# Altium schematic sheet Arduino_schematics.SchDoc: Data Logger - Arduino
size A3; DocumentNumber: DL-MB-2; SheetNumber: 2; SheetTotal: 11
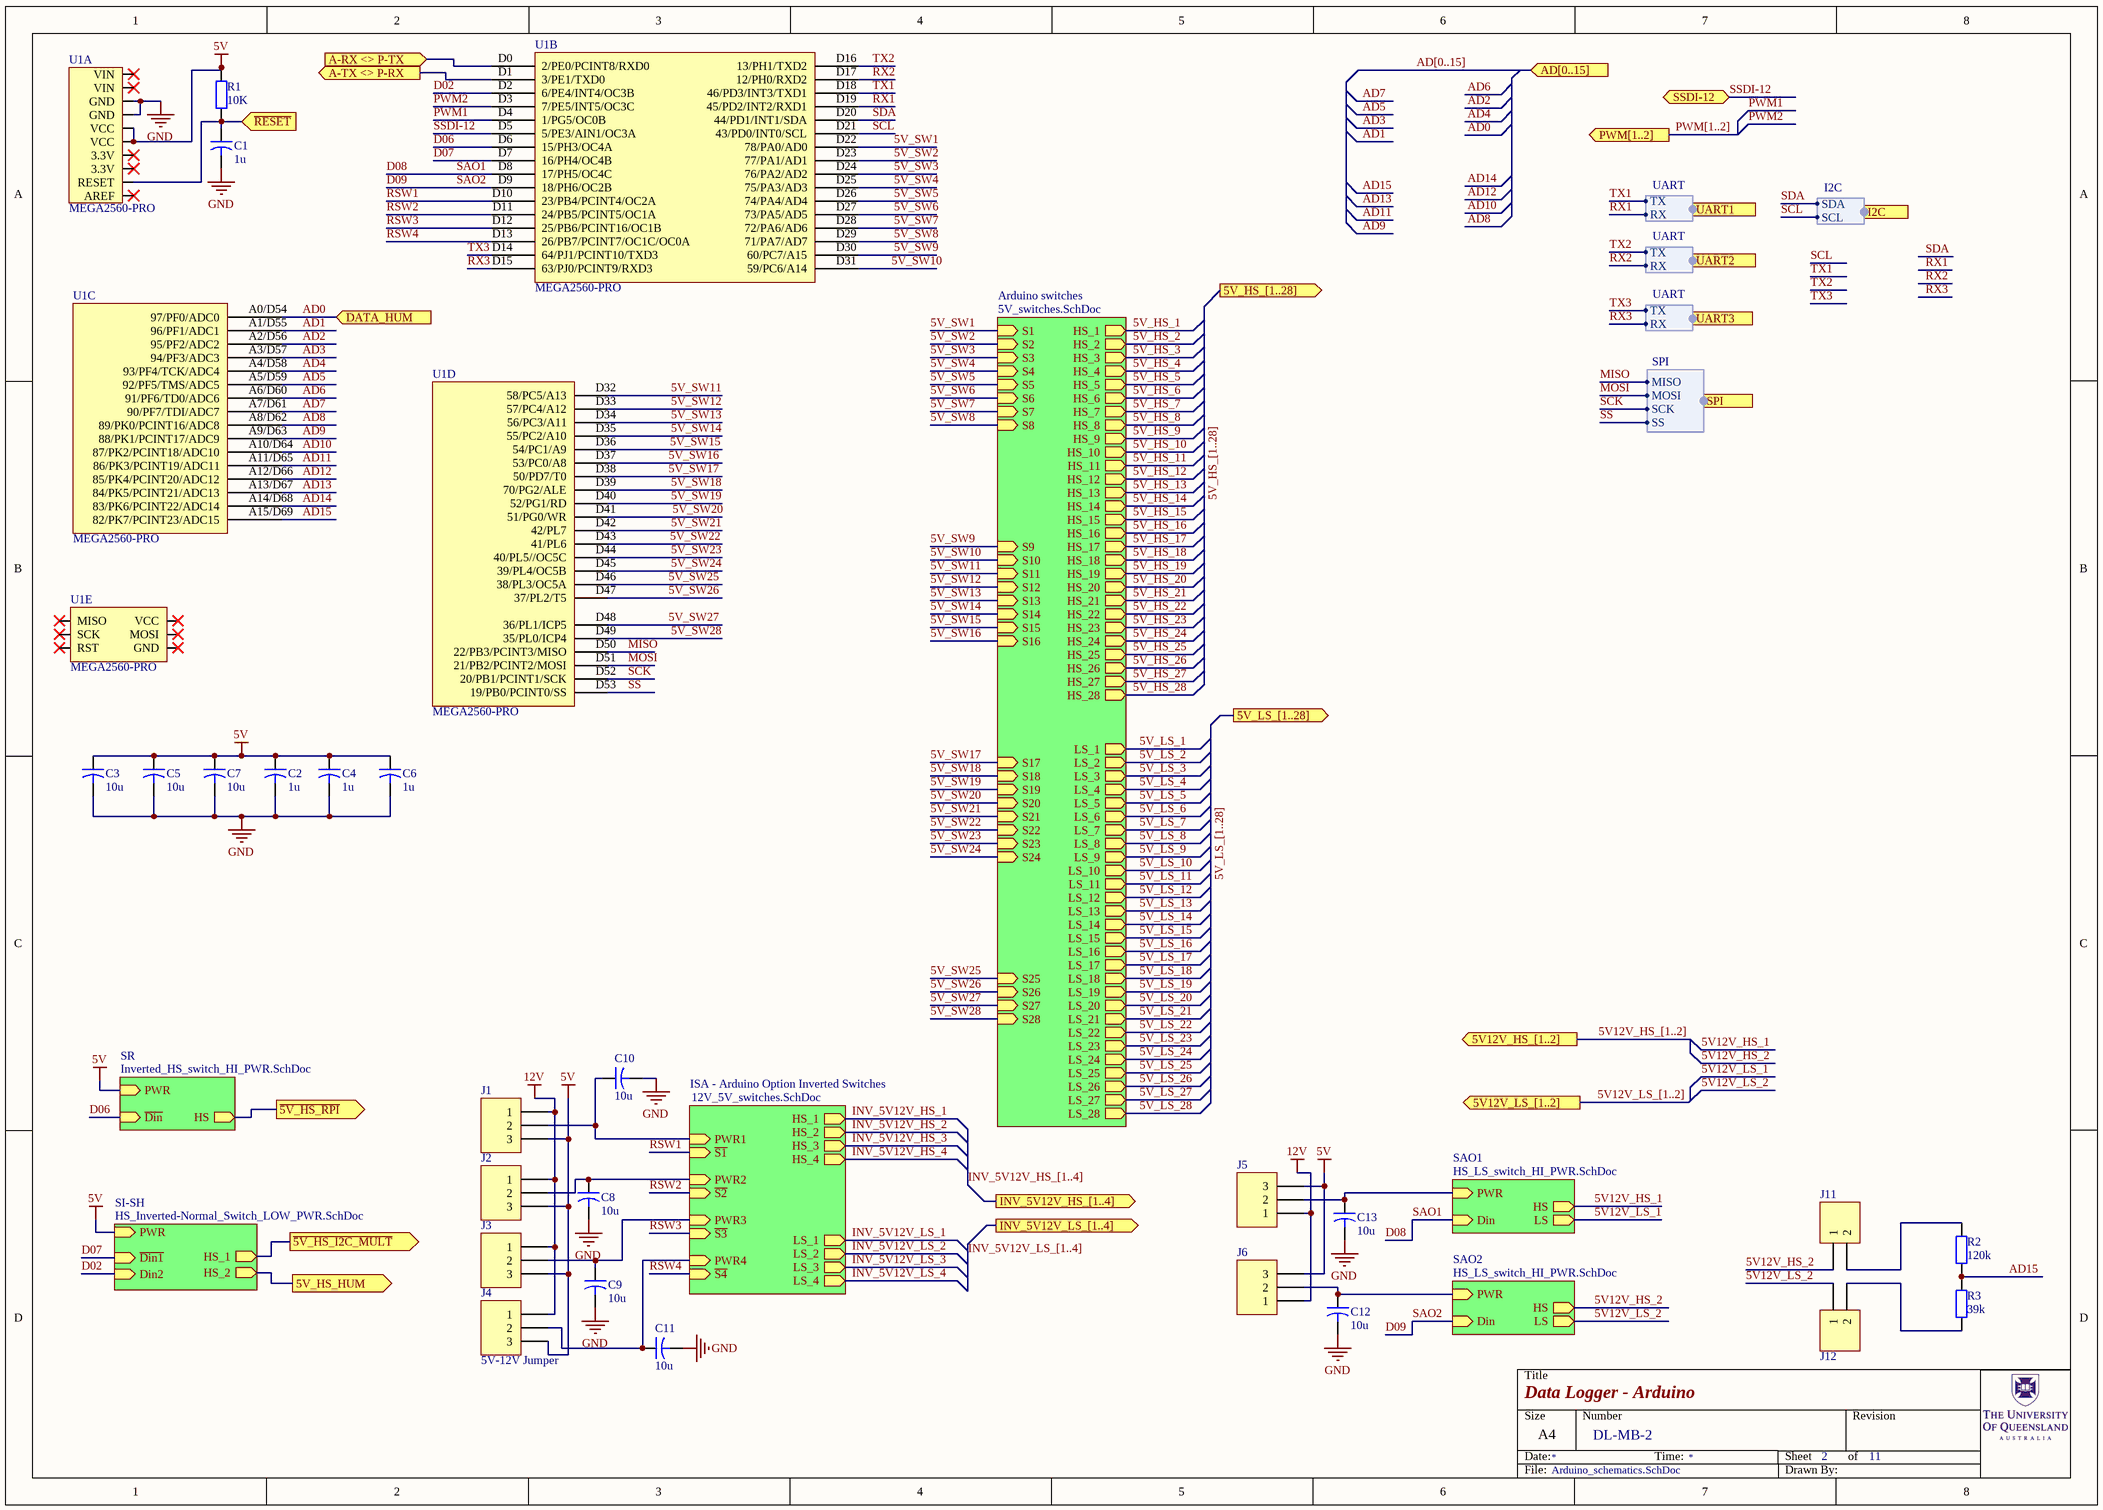
[diagram p0: Arduino_schematics.SchDoc]

## Parts
C1  1u  [CAPR5-4X5]
C2  1u  [CAPR5-4X5]
C3  10u  [CAPAE9083X80M]
C4  1u  [CAPR5-4X5]
C5  10u  [CAPAE9083X80M]
C6  1u  [CAPR5-4X5]
C7  10u  [CAPAE9083X80M]
C8  10u  [CAPAE9083X80M]
C9  10u  [CAPAE9083X80M]
C10  10u  [CAPAE9083X80M]
C11  10u  [CAPAE9083X80M]
C12  10u  [CAPAE9083X80M]
C13  10u  [CAPAE9083X80M]
J1  5V-12V Jumper  [HDR1X3]  (value not drawn)
J2  5V-12V Jumper  [HDR1X3]  (value not drawn)
J3  5V-12V Jumper  [HDR1X3]  (value not drawn)
J4  5V-12V Jumper  [HDR1X3]
J5  Header 3  [HDR1X3]  (value not drawn)
J6  Header 3  [HDR1X3]  (value not drawn)
J11  Header 2  [HDR1X2]  (value not drawn)
J12  Header 2  [HDR1X2]  (value not drawn)
R1  10K  [RES-1206_M]
R2  120k  [RES-1206_M]
R3  39k  [RES-1206_M]
U1  MEGA2560-PRO  [MEGA2560PRO-EMBED-IO]  (parts A,B,C,D,E of 5)

## Sub-sheets
Arduino switches = 5V_switches.SchDoc: S1 (in), S2 (in), S3 (in), S4 (in), S5 (in), S6 (in), S7 (in), S8 (in), S9 (in), S10 (in), S11 (in), S12 (in), S13 (in), S14 (in), S15 (in), S16 (in), S17 (in), S18 (in), S19 (in), S20 (in), S21 (in), S22 (in), S23 (in), S24 (in), S25 (in), S26 (in), S27 (in), HS_1 (out), HS_2 (out), HS_3 (out), HS_4 (out), HS_5 (out), HS_6 (out), HS_7 (out), HS_8 (out), HS_9 (out), HS_10 (out), HS_11 (out), HS_12 (out), HS_13 (out), HS_14 (out), HS_15 (out), HS_16 (out), HS_17 (out), HS_18 (out), HS_19 (out), HS_20 (out), HS_21 (out), HS_22 (out), HS_23 (out), HS_24 (out), HS_25 (out), HS_26 (out), HS_27 (out), S28 (in), HS_28 (out), LS_1 (out), LS_2 (out), LS_3 (out), LS_4 (out), LS_5 (out), LS_6 (out), LS_7 (out), LS_8 (out), LS_9 (out), LS_10 (out), LS_11 (out), LS_12 (out), LS_13 (out), LS_14 (out), LS_15 (out), LS_16 (out), LS_17 (out), LS_18 (out), LS_19 (out), LS_20 (out), LS_21 (out), LS_22 (out), LS_23 (out), LS_24 (out), LS_25 (out), LS_26 (out), LS_27 (out), LS_28 (out)
ISA - Arduino Option Inverted Switches = 12V_5V_switches.SchDoc: ~{S1} (in), ~{S2} (in), ~{S3} (in), ~{S4} (in), HS_1 (out), HS_2 (out), HS_3 (out), HS_4 (out), LS_1 (out), LS_2 (out), LS_3 (out), LS_4 (out), PWR1 (in), PWR2 (in), PWR3 (in), PWR4 (in)
SAO1 = HS_LS_switch_HI_PWR.SchDoc: Din (in), HS (out), LS (out), PWR (in)
SAO2 = HS_LS_switch_HI_PWR.SchDoc: Din (in), HS (out), LS (out), PWR (in)
SI-SH = HS_Inverted-Normal_Switch_LOW_PWR.SchDoc: ~{Din1} (in), HS_1 (out), PWR (in), Din2 (in), HS_2 (out)
SR = Inverted_HS_switch_HI_PWR.SchDoc: ~{Din} (in), HS (out), PWR (in)

## Ports
5V12V_HS_[1..2] (out), 5V12V_LS_[1..2] (out), 5V_HS_[1..28] (out), 5V_HS_HUM (out), 5V_LS_[1..28] (out), A-RX <> P-TX (in), A-TX <> P-RX (out), AD[0..15] (in), DATA_HUM (in), I2C (harness I2C), INV_5V12V_HS_[1..4] (out), INV_5V12V_LS_[1..4] (out), PWM[1..2] (out), SPI (harness SPI), SSDI-12 (bidir), UART1 (harness UART), UART2 (harness UART), UART3 (harness UART), ~{5V_HS_I2C_MULT} (out), ~{5V_HS_RPI} (out), ~{RESET} (in)

## Harnesses
SPI: MISO, MOSI, SCK, SS
UART: TX, RX
I2C: SDA, SCL

## Nets
5V: C2.1 C3.1 C4.1 C5.1 C6.1 C7.1 J1.3 J2.3 J3.3 J4.3 J5.3 J6.3 R1.2 U1.VCC@1(VCC) U1.VCC@2(VCC) ; sheet SI-SH/PWR, sheet SR/PWR
12V: J1.1 J2.1 J3.1 J4.1 J5.1 J6.1
GND: C1.2 C2.2 C3.2 C4.2 C5.2 C6.2 C7.2 C8.2 C9.2 C10.2 C11.2 C12.2 C13.2 U1.GND@1(GND) U1.GND@2(GND)
~{5V_HS_I2C_MULT}: port ~{5V_HS_I2C_MULT}, sheet SI-SH/HS_1
~{5V_HS_RPI}: port ~{5V_HS_RPI}, sheet SR/HS
5V12V_HS_1: sheet SAO1/HS
5V12V_HS_2: J11.1 ; sheet SAO2/HS
5V12V_LS_1: sheet SAO1/LS
5V12V_LS_2: J12.1 ; sheet SAO2/LS
5V_HS_1: sheet Arduino switches/HS_1
5V_HS_2: sheet Arduino switches/HS_2
5V_HS_3: sheet Arduino switches/HS_3
5V_HS_4: sheet Arduino switches/HS_4
5V_HS_5: sheet Arduino switches/HS_5
5V_HS_6: sheet Arduino switches/HS_6
5V_HS_7: sheet Arduino switches/HS_7
5V_HS_8: sheet Arduino switches/HS_8
5V_HS_9: sheet Arduino switches/HS_9
5V_HS_10: sheet Arduino switches/HS_10
5V_HS_11: sheet Arduino switches/HS_11
5V_HS_12: sheet Arduino switches/HS_12
5V_HS_13: sheet Arduino switches/HS_13
5V_HS_14: sheet Arduino switches/HS_14
5V_HS_15: sheet Arduino switches/HS_15
5V_HS_16: sheet Arduino switches/HS_16
5V_HS_17: sheet Arduino switches/HS_17
5V_HS_18: sheet Arduino switches/HS_18
5V_HS_19: sheet Arduino switches/HS_19
5V_HS_20: sheet Arduino switches/HS_20
5V_HS_21: sheet Arduino switches/HS_21
5V_HS_22: sheet Arduino switches/HS_22
5V_HS_23: sheet Arduino switches/HS_23
5V_HS_24: sheet Arduino switches/HS_24
5V_HS_25: sheet Arduino switches/HS_25
5V_HS_26: sheet Arduino switches/HS_26
5V_HS_27: sheet Arduino switches/HS_27
5V_HS_28: sheet Arduino switches/HS_28
5V_HS_HUM: port 5V_HS_HUM, sheet SI-SH/HS_2
5V_LS_1: sheet Arduino switches/LS_1
5V_LS_2: sheet Arduino switches/LS_2
5V_LS_3: sheet Arduino switches/LS_3
5V_LS_4: sheet Arduino switches/LS_4
5V_LS_5: sheet Arduino switches/LS_5
5V_LS_6: sheet Arduino switches/LS_6
5V_LS_7: sheet Arduino switches/LS_7
5V_LS_8: sheet Arduino switches/LS_8
5V_LS_9: sheet Arduino switches/LS_9
5V_LS_10: sheet Arduino switches/LS_10
5V_LS_11: sheet Arduino switches/LS_11
5V_LS_12: sheet Arduino switches/LS_12
5V_LS_13: sheet Arduino switches/LS_13
5V_LS_14: sheet Arduino switches/LS_14
5V_LS_15: sheet Arduino switches/LS_15
5V_LS_16: sheet Arduino switches/LS_16
5V_LS_17: sheet Arduino switches/LS_17
5V_LS_18: sheet Arduino switches/LS_18
5V_LS_19: sheet Arduino switches/LS_19
5V_LS_20: sheet Arduino switches/LS_20
5V_LS_21: sheet Arduino switches/LS_21
5V_LS_22: sheet Arduino switches/LS_22
5V_LS_23: sheet Arduino switches/LS_23
5V_LS_24: sheet Arduino switches/LS_24
5V_LS_25: sheet Arduino switches/LS_25
5V_LS_26: sheet Arduino switches/LS_26
5V_LS_27: sheet Arduino switches/LS_27
5V_LS_28: sheet Arduino switches/LS_28
5V_SW1: U1.D22(78/PA0/AD0) ; sheet Arduino switches/S1
5V_SW2: U1.D23(77/PA1/AD1) ; sheet Arduino switches/S2
5V_SW3: U1.D24(76/PA2/AD2) ; sheet Arduino switches/S3
5V_SW4: U1.D25(75/PA3/AD3) ; sheet Arduino switches/S4
5V_SW5: U1.D26(74/PA4/AD4) ; sheet Arduino switches/S5
5V_SW6: U1.D27(73/PA5/AD5) ; sheet Arduino switches/S6
5V_SW7: U1.D28(72/PA6/AD6) ; sheet Arduino switches/S7
5V_SW8: U1.D29(71/PA7/AD7) ; sheet Arduino switches/S8
5V_SW9: U1.D30(60/PC7/A15) ; sheet Arduino switches/S9
5V_SW10: U1.D31(59/PC6/A14) ; sheet Arduino switches/S10
5V_SW11: U1.D32(58/PC5/A13) ; sheet Arduino switches/S11
5V_SW12: U1.D33(57/PC4/A12) ; sheet Arduino switches/S12
5V_SW13: U1.D34(56/PC3/A11) ; sheet Arduino switches/S13
5V_SW14: U1.D35(55/PC2/A10) ; sheet Arduino switches/S14
5V_SW15: U1.D36(54/PC1/A9) ; sheet Arduino switches/S15
5V_SW16: U1.D37(53/PC0/A8) ; sheet Arduino switches/S16
5V_SW17: U1.D38(50/PD7/T0) ; sheet Arduino switches/S17
5V_SW18: U1.D39(70/PG2/ALE) ; sheet Arduino switches/S18
5V_SW19: U1.D40(52/PG1/RD) ; sheet Arduino switches/S19
5V_SW20: U1.D41(51/PG0/WR) ; sheet Arduino switches/S20
5V_SW21: U1.D42(42/PL7) ; sheet Arduino switches/S21
5V_SW22: U1.D43(41/PL6) ; sheet Arduino switches/S22
5V_SW23: U1.D44(40/PL5//OC5C) ; sheet Arduino switches/S23
5V_SW24: U1.D45(39/PL4/OC5B) ; sheet Arduino switches/S24
5V_SW25: U1.D46(38/PL3/OC5A) ; sheet Arduino switches/S25
5V_SW26: U1.D47(37/PL2/T5) ; sheet Arduino switches/S26
5V_SW27: U1.D48(36/PL1/ICP5) ; sheet Arduino switches/S27
5V_SW28: U1.D49(35/PL0/ICP4) ; sheet Arduino switches/S28
A-RX <> P-TX: U1.D0(2/PE0/PCINT8/RXD0) ; port A-RX <> P-TX
A-TX <> P-RX: U1.D1(3/PE1/TXD0) ; port A-TX <> P-RX
AD0: U1.A0/D54(97/PF0/ADC0) ; port DATA_HUM
AD1: U1.A1/D55(96/PF1/ADC1)
AD2: U1.A2/D56(95/PF2/ADC2)
AD3: U1.A3/D57(94/PF3/ADC3)
AD4: U1.A4/D58(93/PF4/TCK/ADC4)
AD5: U1.A5/D59(92/PF5/TMS/ADC5)
AD6: U1.A6/D60(91/PF6/TD0/ADC6)
AD7: U1.A7/D61(90/PF7/TDI/ADC7)
AD8: U1.A8/D62(89/PK0/PCINT16/ADC8)
AD9: U1.A9/D63(88/PK1/PCINT17/ADC9)
AD10: U1.A10/D64(87/PK2/PCINT18/ADC10)
AD11: U1.A11/D65(86/PK3/PCINT19/ADC11)
AD12: U1.A12/D66(85/PK4/PCINT20/ADC12)
AD13: U1.A13/D67(84/PK5/PCINT21/ADC13)
AD14: U1.A14/D68(83/PK6/PCINT22/ADC14)
AD15: R2.1 R3.2 U1.A15/D69(82/PK7/PCINT23/ADC15)
D02: U1.D2(6/PE4/INT4/OC3B) ; sheet SI-SH/Din2
D06: U1.D6(15/PH3/OC4A) ; sheet SR/~{Din}
D07: U1.D7(16/PH4/OC4B) ; sheet SI-SH/~{Din1}
D08: U1.D8(17/PH5/OC4C) ; sheet SAO1/Din  [also labelled SAO1]
D09: U1.D9(18/PH6/OC2B) ; sheet SAO2/Din  [also labelled SAO2]
INV_5V12V_HS_1: sheet ISA - Arduino Option Inverted Switches/HS_1
INV_5V12V_HS_2: sheet ISA - Arduino Option Inverted Switches/HS_2
INV_5V12V_HS_3: sheet ISA - Arduino Option Inverted Switches/HS_3
INV_5V12V_HS_4: sheet ISA - Arduino Option Inverted Switches/HS_4
INV_5V12V_LS_1: sheet ISA - Arduino Option Inverted Switches/LS_1
INV_5V12V_LS_2: sheet ISA - Arduino Option Inverted Switches/LS_2
INV_5V12V_LS_3: sheet ISA - Arduino Option Inverted Switches/LS_3
INV_5V12V_LS_4: sheet ISA - Arduino Option Inverted Switches/LS_4
MISO: U1.D50(22/PB3/PCINT3/MISO) ; port SPI.MISO
MOSI: U1.D51(21/PB2/PCINT2/MOSI) ; port SPI.MOSI
PWM1: U1.D4(1/PG5/OC0B)
PWM2: U1.D3(7/PE5/INT5/OC3C)
~{RESET}: C1.1 R1.1 U1.RST@1(RESET) ; port ~{RESET}
RSW1: U1.D10(23/PB4/PCINT4/OC2A) ; sheet ISA - Arduino Option Inverted Switches/~{S1}
RSW2: U1.D11(24/PB5/PCINT5/OC1A) ; sheet ISA - Arduino Option Inverted Switches/~{S2}
RSW3: U1.D12(25/PB6/PCINT16/OC1B) ; sheet ISA - Arduino Option Inverted Switches/~{S3}
RSW4: U1.D13(26/PB7/PCINT7/OC1C/OC0A) ; sheet ISA - Arduino Option Inverted Switches/~{S4}
RX1: U1.D19(45/PD2/INT2/RXD1) ; port UART1.RX
RX2: U1.D17(12/PH0/RXD2) ; port UART2.RX
RX3: U1.D15(63/PJ0/PCINT9/RXD3) ; port UART3.RX
SCK: U1.D52(20/PB1/PCINT1/SCK) ; port SPI.SCK
SCL: U1.D21(43/PD0/INT0/SCL) ; port I2C.SCL
SDA: U1.D20(44/PD1/INT1/SDA) ; port I2C.SDA
SS: U1.D53(19/PB0/PCINT0/SS) ; port SPI.SS
SSDI-12: U1.D5(5/PE3/AIN1/OC3A) ; port SSDI-12
TX1: U1.D18(46/PD3/INT3/TXD1) ; port UART1.TX
TX2: U1.D16(13/PH1/TXD2) ; port UART2.TX
TX3: U1.D14(64/PJ1/PCINT10/TXD3) ; port UART3.TX
NetC8_1: C8.1 J2.2 ; sheet ISA - Arduino Option Inverted Switches/PWR2
NetC9_1: C9.1 J3.2 ; sheet ISA - Arduino Option Inverted Switches/PWR3
NetC10_1: C10.1 J1.2 ; sheet ISA - Arduino Option Inverted Switches/PWR1
NetC11_1: C11.1 J4.2 ; sheet ISA - Arduino Option Inverted Switches/PWR4
NetC12_1: C12.1 J6.2 ; sheet SAO2/PWR
NetC13_1: C13.1 J5.2 ; sheet SAO1/PWR
NetJ11_2: J11.2 R2.2
NetJ12_2: J12.2 R3.1

Not connected (* = marked no-connect by the designer): U1 3.3V@1(3.3V)* 3.3V@2(3.3V)* 5V@3(VCC)* AREF* GND@3(GND)* MISO* MOSI* RESET(RST)* SCK* VIN@1(VIN)* VIN@2(VIN)*

## Buses and harness runs
bus 5V12V_HS_[1..2] = port 5V12V_HS_[1..2]
bus 5V12V_LS_[1..2] = port 5V12V_LS_[1..2]
bus 5V_HS_[1..28] = port 5V_HS_[1..28]
bus 5V_LS_[1..28] = port 5V_LS_[1..28]
bus AD[0..15] = port AD[0..15]
bus INV_5V12V_HS_[1..4] = port INV_5V12V_HS_[1..4]
bus INV_5V12V_LS_[1..4] = port INV_5V12V_LS_[1..4]
bus PWM[1..2] = port PWM[1..2]

## Notes on the sheet
- Title
- Size
- Date:
- A4
- Number
- Time:
- Sheet
- of
- Revision
- File:
- Drawn By:

## Library data of the parts
C1-C13 = Cap Pol1: Capacitor; Publisher: Altium Limited; PackageDescription: Polarized Capacitor; 2 Leads
  C1 C2 C4 C6: Published: 23-Sep-02; Value: 1u; Link: https://au.rs-online.com/web/p/ceramic-multilayer-capacitors/6995137/
  C3 C5 C7: Published: 23-Sep-2002; Value: 10u
  C8-C13: Published: 23-Sep-02; Value: 10u; Link: https://au.rs-online.com/web/p/aluminium-capacitors/2244325/
J1 = Header 3: Header, 3-Pin / ISA1 (D10), Inverted Switch 12V-5V Select; LatestRevisionDate: 17-Jul-2002; LatestRevisionNote: Re-released for DXP Platform.; Publisher: Altium Limited
J2 = Header 3: Header, 3-Pin / ISA2 (D11), Inverted Switch 12V-5V Select; LatestRevisionDate: 17-Jul-2002; LatestRevisionNote: Re-released for DXP Platform.; Publisher: Altium Limited
J3 = Header 3: Header, 3-Pin / ISA3 (D12), Inverted Switch 12V-5V Select; LatestRevisionDate: 17-Jul-2002; LatestRevisionNote: Re-released for DXP Platform.; Publisher: Altium Limited
J4 = Header 3: Header, 3-Pin / ISA4 (D13), Inverted Switch 12V-5V Select; LatestRevisionDate: 17-Jul-2002; LatestRevisionNote: Re-released for DXP Platform.; Publisher: Altium Limited
J5 = Header 3: Header, 3-Pin / SAO1 (D8), 12V 5V Select; LatestRevisionDate: 17-Jul-2002; LatestRevisionNote: Re-released for DXP Platform.; Publisher: Altium Limited
J6 = Header 3: Header, 3-Pin / SAO2 (D9), 12V 5V Select; LatestRevisionDate: 17-Jul-2002; LatestRevisionNote: Re-released for DXP Platform.; Publisher: Altium Limited
J11 = Header 2: Header, 2-Pin / VSense, HS; LatestRevisionDate: 17-Jul-2002; LatestRevisionNote: Re-released for DXP Platform.; Publisher: Altium Limited
J12 = Header 2: Header, 2-Pin / VSense, LS; LatestRevisionDate: 17-Jul-2002; LatestRevisionNote: Re-released for DXP Platform.; Publisher: Altium Limited
R1-R3 = Res2: Resistor; Published: 8-Jun-2000; LatestRevisionDate: 17-Jul-2002; LatestRevisionNote: Re-released for DXP Platform.; PackageReference: 1206; Publisher: Altium Limited; PackageDescription: Chip Resistor 1206 Case Size
  R1: Value: 10K
  R2: Value: 120k
  R3: Value: 39k
U1 = MEGA2560-PRO: RoboDyn Mega2560 Pro (Embed) CH340G; ComponentLink1Description: Robodyn; ComponentLink1URL: https://robotdyn.com/mega-2560-pro-embed-ch340g-atmega2560-16au.html